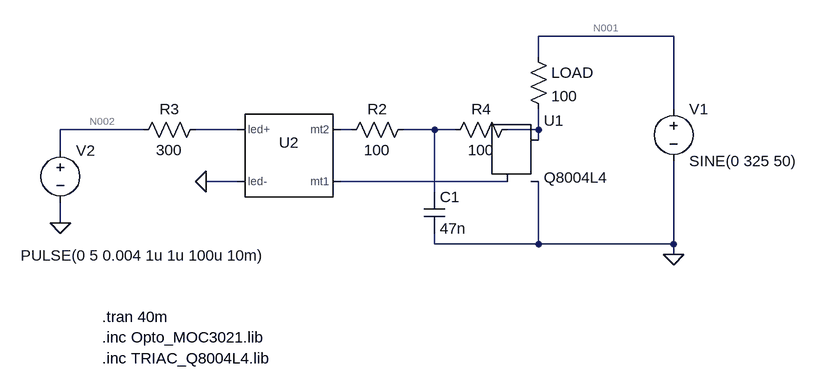
[diagram p0: schematic v2.1.asc]
v2.1.asc, the LTspice schematic file:
Version 4.1
SHEET 1 1132 824
WIRE -288 -96 -496 -96
WIRE -496 -64 -496 -96
WIRE -288 16 -288 -96
WIRE -1104 48 -1232 48
WIRE -960 48 -1024 48
WIRE -784 48 -800 48
WIRE -656 48 -704 48
WIRE -624 48 -656 48
WIRE -496 48 -496 16
WIRE -496 48 -544 48
WIRE -496 64 -496 48
WIRE -1232 80 -1232 48
WIRE -960 128 -1008 128
WIRE -544 128 -800 128
WIRE -656 144 -656 48
WIRE -1232 192 -1232 160
WIRE -656 224 -656 208
WIRE -496 224 -496 128
WIRE -496 224 -656 224
WIRE -288 224 -288 96
WIRE -288 224 -496 224
WIRE -288 240 -288 224
FLAG -288 240 0
FLAG -1232 192 0
FLAG -1008 128 0
SYMBOL Misc\\TRIAC -528 64 R0
SYMATTR InstName U1
SYMATTR Value Q8004L4
SYMBOL res -512 -80 R0
SYMATTR InstName LOAD
SYMATTR Value 100
SYMBOL res -800 64 R270
WINDOW 0 32 56 VTop 2
WINDOW 3 0 56 VBottom 2
SYMATTR InstName R2
SYMATTR Value 100
SYMBOL voltage -288 0 R0
WINDOW 123 0 0 Left 0
WINDOW 39 0 0 Left 0
SYMATTR InstName V1
SYMATTR Value SINE(0 325 50)
SYMBOL res -1120 64 R270
WINDOW 0 32 56 VTop 2
WINDOW 3 0 56 VBottom 2
SYMATTR InstName R3
SYMATTR Value 300
SYMBOL voltage -1232 64 R0
WINDOW 3 -61 178 Left 2
WINDOW 123 0 0 Left 0
WINDOW 39 0 0 Left 0
SYMATTR Value PULSE(0 5 0.004 1u 1u 100u 10m)
SYMATTR InstName V2
SYMBOL res -640 64 R270
WINDOW 0 32 56 VTop 2
WINDOW 3 0 56 VBottom 2
SYMATTR InstName R4
SYMATTR Value 100
SYMBOL cap -672 144 R0
SYMATTR InstName C1
SYMATTR Value 47n
SYMBOL Extra\\Opto_MOC30xx -912 64 R0
SYMATTR SpiceModel MOC3021
SYMATTR InstName U2
TEXT -1168 336 Left 2 !.tran 40m
TEXT -1168 368 Left 2 !.inc Opto_MOC3021.lib
TEXT -1168 400 Left 2 !.inc TRIAC_Q8004L4.lib

The netlist it stands for:
* v2.1.asc
X§U1 N006 N007 0 Q8004L4  ; pins MT2 G MT1
R§LOAD N001 N006 100
R2 N004 N005 100
V1 N001 0 SINE(0 325 50)
R3 N002 N003 300
V2 N002 0 PULSE(0 5 0.004 1u 1u 100u 10m)
R4 N005 N006 100
C1 N005 0 47n
X§U2 N003 0 N004 N007 MOC3021  ; pins led+ led- mt2 mt1
.tran 40m
.inc Opto_MOC3021.lib
.inc TRIAC_Q8004L4.lib
.backanno
.end

* Results of the author's LTspice run, read from the files saved beside the schematic
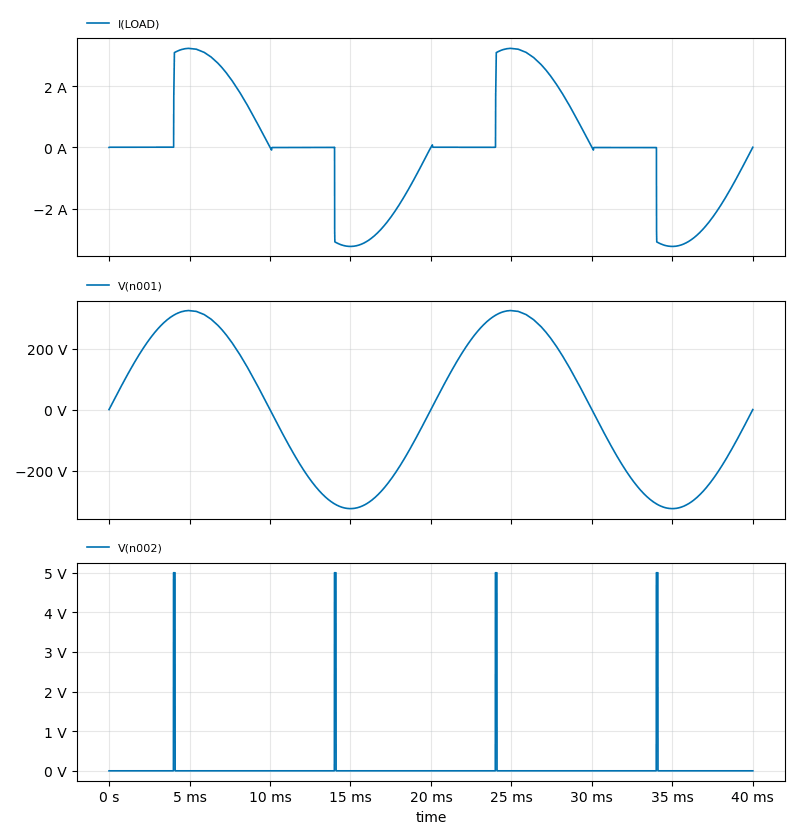
[diagram p1: Transient Analysis of v2.1.asc, plotted from the saved traces]
* Transient Analysis, 1 run:
*   I(LOAD): min -3.238 A, max 3.237 A, average -2.656 mA, rms 1.899 A, last 3.584 mA
*   V(n001): min -325 V, max 324.9 V, average -79.56 mV, rms 229.8 V, last 0 V
*   V(n002): min 0 V, max 5 V, average 50.5 mV, rms 501.9 mV, last 0 V